# EAGLE design BC08J (EAGLE 6.6.0)
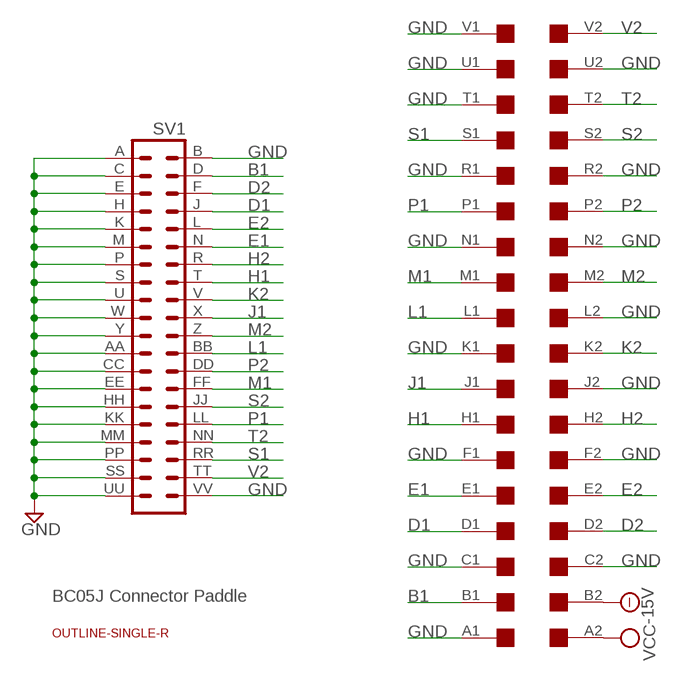
[diagram p0: schematic, sheet 1]

## Parts
SV1  DEC40PINV  [DEC40PINV]
U$1  SINGLE  [EDGE-CON2]
U$2  OUTLINE-SINGLE-R  [SINGLE-R]

## Nets
-15V: U$1.B2
B1: SV1.D U$1.B1
D1: SV1.J U$1.D1
D2: SV1.F U$1.D2
E1: SV1.N U$1.E1
E2: SV1.L U$1.E2
GND: SV1.A SV1.AA SV1.B SV1.C SV1.CC SV1.E SV1.EE SV1.H SV1.HH SV1.K SV1.KK SV1.M SV1.MM SV1.P SV1.PP SV1.S SV1.SS SV1.U SV1.UU SV1.VV SV1.W SV1.Y U$1.A1 U$1.C1 U$1.C2 U$1.F1 U$1.F2 U$1.J2 U$1.K1 U$1.L2 U$1.N1 U$1.N2 U$1.R1 U$1.R2 U$1.T1 U$1.U1 U$1.U2 U$1.V1
H1: SV1.T U$1.H1
H2: SV1.R U$1.H2
J1: SV1.X U$1.J1
K2: SV1.V U$1.K2
L1: SV1.BB U$1.L1
M1: SV1.FF U$1.M1
M2: SV1.Z U$1.M2
P1: SV1.LL U$1.P1
P2: SV1.DD U$1.P2
S1: SV1.RR U$1.S1
S2: SV1.JJ U$1.S2
T2: SV1.NN U$1.T2
V2: SV1.TT U$1.V2
VCC: U$1.A2

## Notes on the sheet
- BC05J Connector Paddle

## Library data of the parts
SV1 = dec-con:DEC40PIN: PIN HEADER
U$1 = dec-con:SINGLE: Single-Height DEC board
U$2 = dec-con:OUTLINE-*: Board outlines for DEC boards.

## Board
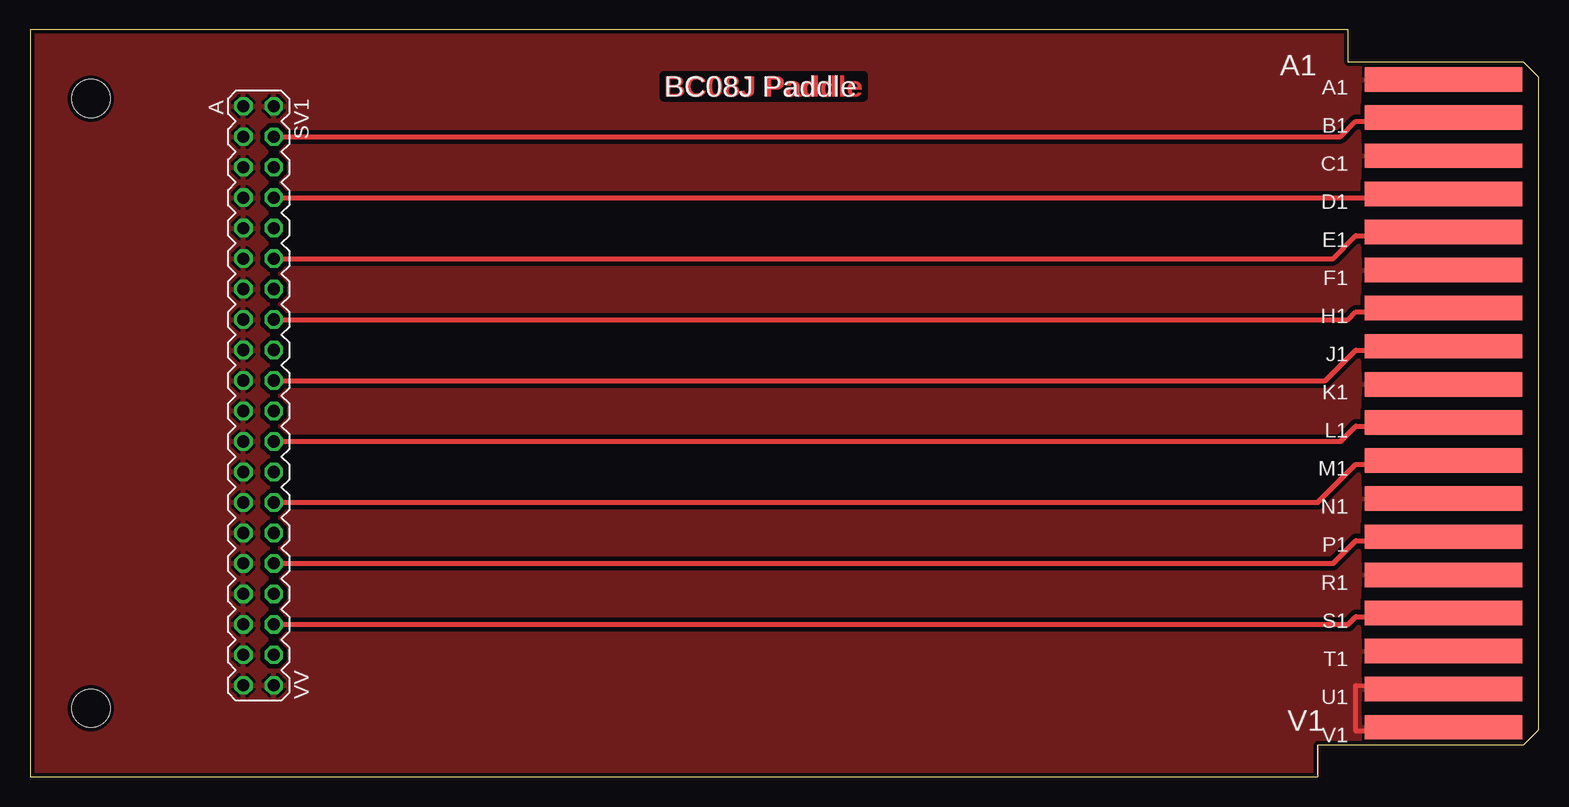
[diagram p1: board, top side]
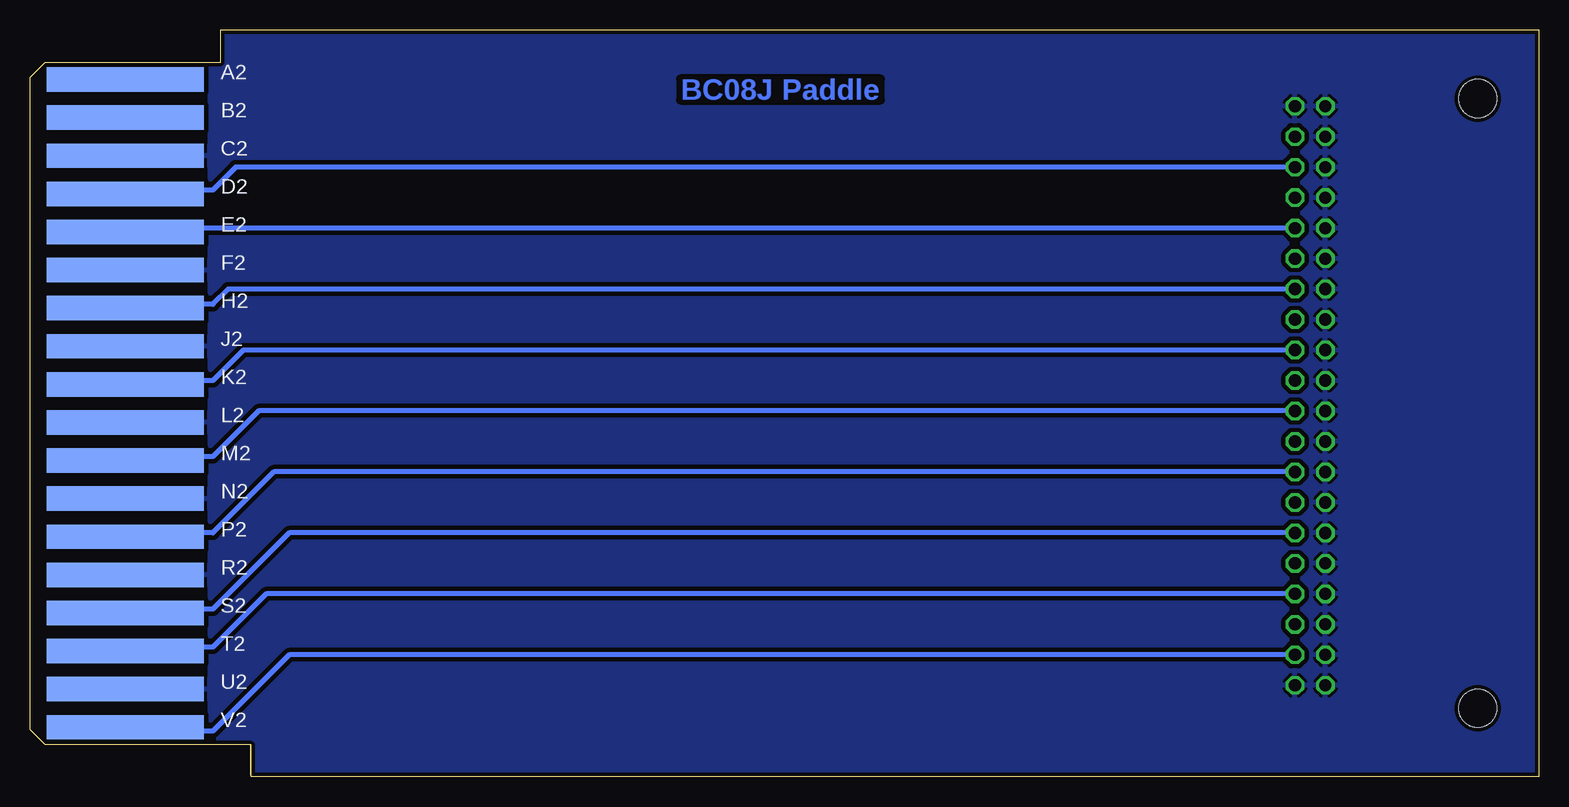
[diagram p2: board, bottom side, seen from below]

Size 125.73 x 62.23 mm. Coordinates in mm from the lower left corner, seen from the top.
Copper layers (1+16): Top 0.035mm / dielectric 1.5mm / Bottom 0.035mm
Design rules "16mils": minimum track width 16mil, minimum drill 32mil, track to track 15mil, track to pad 10mil, pad to pad 10mil, via to via 10mil, smd to smd 10mil, copper to edge 13mil, drill to drill 10mil, minimum pad ring 10mil, minimum via ring 8mil, stop-mask expansion 0mil, vias tented up to drill 0mil, thermal gap 10mil

### Footprints (pad centres in the part's own frame; a part is rotated, then mirrored left to right if it is on the bottom)
DEC40PINV = drill 1.016 octagon: A -24.13,-1.27; AA 3.81,-1.27; B -24.13,1.27; BB 3.81,1.27; C -21.59,-1.27; CC 6.35,-1.27; D -21.59,1.27; DD 6.35,1.27; E -19.05,-1.27; EE 8.89,-1.27; F -19.05,1.27; FF 8.89,1.27; H -16.51,-1.27; HH 11.43,-1.27; J -16.51,1.27; JJ 11.43,1.27; K -13.97,-1.27; KK 13.97,-1.27; L -13.97,1.27; LL 13.97,1.27; M -11.43,-1.27; MM 16.51,-1.27; N -11.43,1.27; NN 16.51,1.27; P -8.89,-1.27; PP 19.05,-1.27; R -8.89,1.27; RR 19.05,1.27; S -6.35,-1.27; SS 21.59,-1.27; T -6.35,1.27; TT 21.59,1.27; U -3.81,-1.27; UU 24.13,-1.27; V -3.81,1.27; VV 24.13,1.27; W -1.27,-1.27; X -1.27,1.27; Y 1.27,-1.27; Z 1.27,1.27
EDGE-CON2 = smd 13.106 x 2.032: A1 7.938,4.128; B1 7.938,7.303; C1 7.938,10.477; D1 7.938,13.652; E1 7.938,16.828; F1 7.938,20.003; H1 7.938,23.177; J1 7.938,26.352; K1 7.938,29.527; L1 7.938,32.703; M1 7.938,35.877; N1 7.938,39.053; P1 7.938,42.227; R1 7.938,45.403; S1 7.938,48.578; T1 7.938,51.752; U1 7.938,54.928; V1 7.938,58.102 | smd 13.106 x 2.032 bottom: A2 7.938,4.128; B2 7.938,7.303; C2 7.938,10.477; D2 7.938,13.652; E2 7.938,16.828; F2 7.938,20.003; H2 7.938,23.177; J2 7.938,26.352; K2 7.938,29.527; L2 7.938,32.703; M2 7.938,35.877; N2 7.938,39.053; P2 7.938,42.227; R2 7.938,45.403; S2 7.938,48.578; T2 7.938,51.752; U2 7.938,54.928; V2 7.938,58.102
SINGLE-R = hole 3.175: 5.08,5.715; 5.08,56.515

### Placement (x,y rotation side)
SV1  19.05,31.75 270 top
U$1  125.73,62.23 180 top
U$2  0,0 0 top

### Tracks (layer width: path | path; a pad name or v marks a point on that pad's centre or on a via)
B1
  Top 0.406: SV1.D 20.95,53.34 109.22,53.34 110.49,54.61 111.76,54.61 U$1.B1
D1
  Top 0.406: SV1.J 20.95,48.26 111.76,48.26 U$1.D1
D2
  Bottom 0.406: SV1.F 20.95,50.8 108.58,50.8 110.49,48.9 111.76,48.9 U$1.D2
E1
  Top 0.406: SV1.N 20.95,43.18 108.58,43.18 110.49,45.09 111.76,45.09 U$1.E1
E2
  Bottom 0.406: SV1.L 20.95,45.72 111.76,45.72 U$1.E2
GND
  Top 0.406: 111.76,3.81 U$1.V1 111.76,3.81 | 111.76,3.81 110.49,3.81 110.49,7.62 U$1.U1 | U$1.T1 111.76,10.16 111.76,10.29 | U$1.R1 111.76,16.51 111.76,16.64 | U$1.N1 111.76,22.86 111.76,22.99 | U$1.K1 111.76,32.38 111.76,32.51 | U$1.F1 111.76,41.91 111.76,41.99 | U$1.C1 111.76,51.44 111.76,51.55 | U$1.A1 111.76,57.78 111.76,57.82
  Bottom 0.406: U$1.U1 111.76,6.99 111.76,7.06 | U$1.R1 111.76,16.51 111.76,16.64 | U$1.N1 111.76,22.86 111.76,22.99 | U$1.L2 111.76,29.21 111.76,29.34 | U$1.J2 111.76,35.56 111.76,35.69 | U$1.F1 111.76,41.91 111.76,41.99 | U$1.C1 111.76,51.44 111.76,51.54
  pour Top (isolate 0.305): 111.76,0 0,0 0,62.23 111.76,62.23
  pour Bottom (isolate 0.305): 111.76,0 0,0 0,62.23 111.76,62.23
H1
  Top 0.406: SV1.T 20.95,38.1 109.86,38.1 110.49,38.73 111.76,38.73 U$1.H1
H2
  Bottom 0.406: SV1.R 20.95,40.64 109.22,40.64 110.49,39.37 111.76,39.37 U$1.H2
J1
  Top 0.406: SV1.X 20.95,33.02 107.95,33.02 110.49,35.56 111.76,35.56 U$1.J1
K2
  Bottom 0.406: SV1.V 20.95,35.56 107.95,35.56 110.49,33.02 111.76,33.02 U$1.K2
L1
  Top 0.406: SV1.BB 20.95,27.94 109.22,27.94 110.49,29.21 111.76,29.21 U$1.L1
M1
  Top 0.406: SV1.FF 20.95,22.86 107.31,22.86 110.49,26.04 111.76,26.04 U$1.M1
M2
  Bottom 0.406: SV1.Z 20.95,30.48 106.68,30.48 110.49,26.67 111.76,26.67 U$1.M2
P1
  Top 0.406: SV1.LL 20.95,17.78 108.58,17.78 110.49,19.68 111.76,19.68 U$1.P1
P2
  Bottom 0.406: SV1.DD 20.95,25.4 105.41,25.4 110.49,20.32 111.76,20.32 U$1.P2
S1
  Top 0.406: SV1.RR 20.95,12.7 109.86,12.7 110.49,13.34 111.76,13.34 U$1.S1
S2
  Bottom 0.406: SV1.JJ 20.95,20.32 104.14,20.32 110.49,13.97 111.76,13.97 U$1.S2
T2
  Bottom 0.406: SV1.NN 20.95,15.24 106.05,15.24 110.49,10.79 111.76,10.79 U$1.T2
V2
  Bottom 0.406: SV1.TT 104.14,10.16 110.49,3.81 111.76,3.81 U$1.V2

### Text on the board
Top: BC08J Paddle
Bottom: BC08J Paddle
tPlace: BC08J Paddle
tNames: A1 | V1